# Altium schematic sheet Sheet1.SchDoc
size A3; SheetNumber: 1; SheetTotal: 1
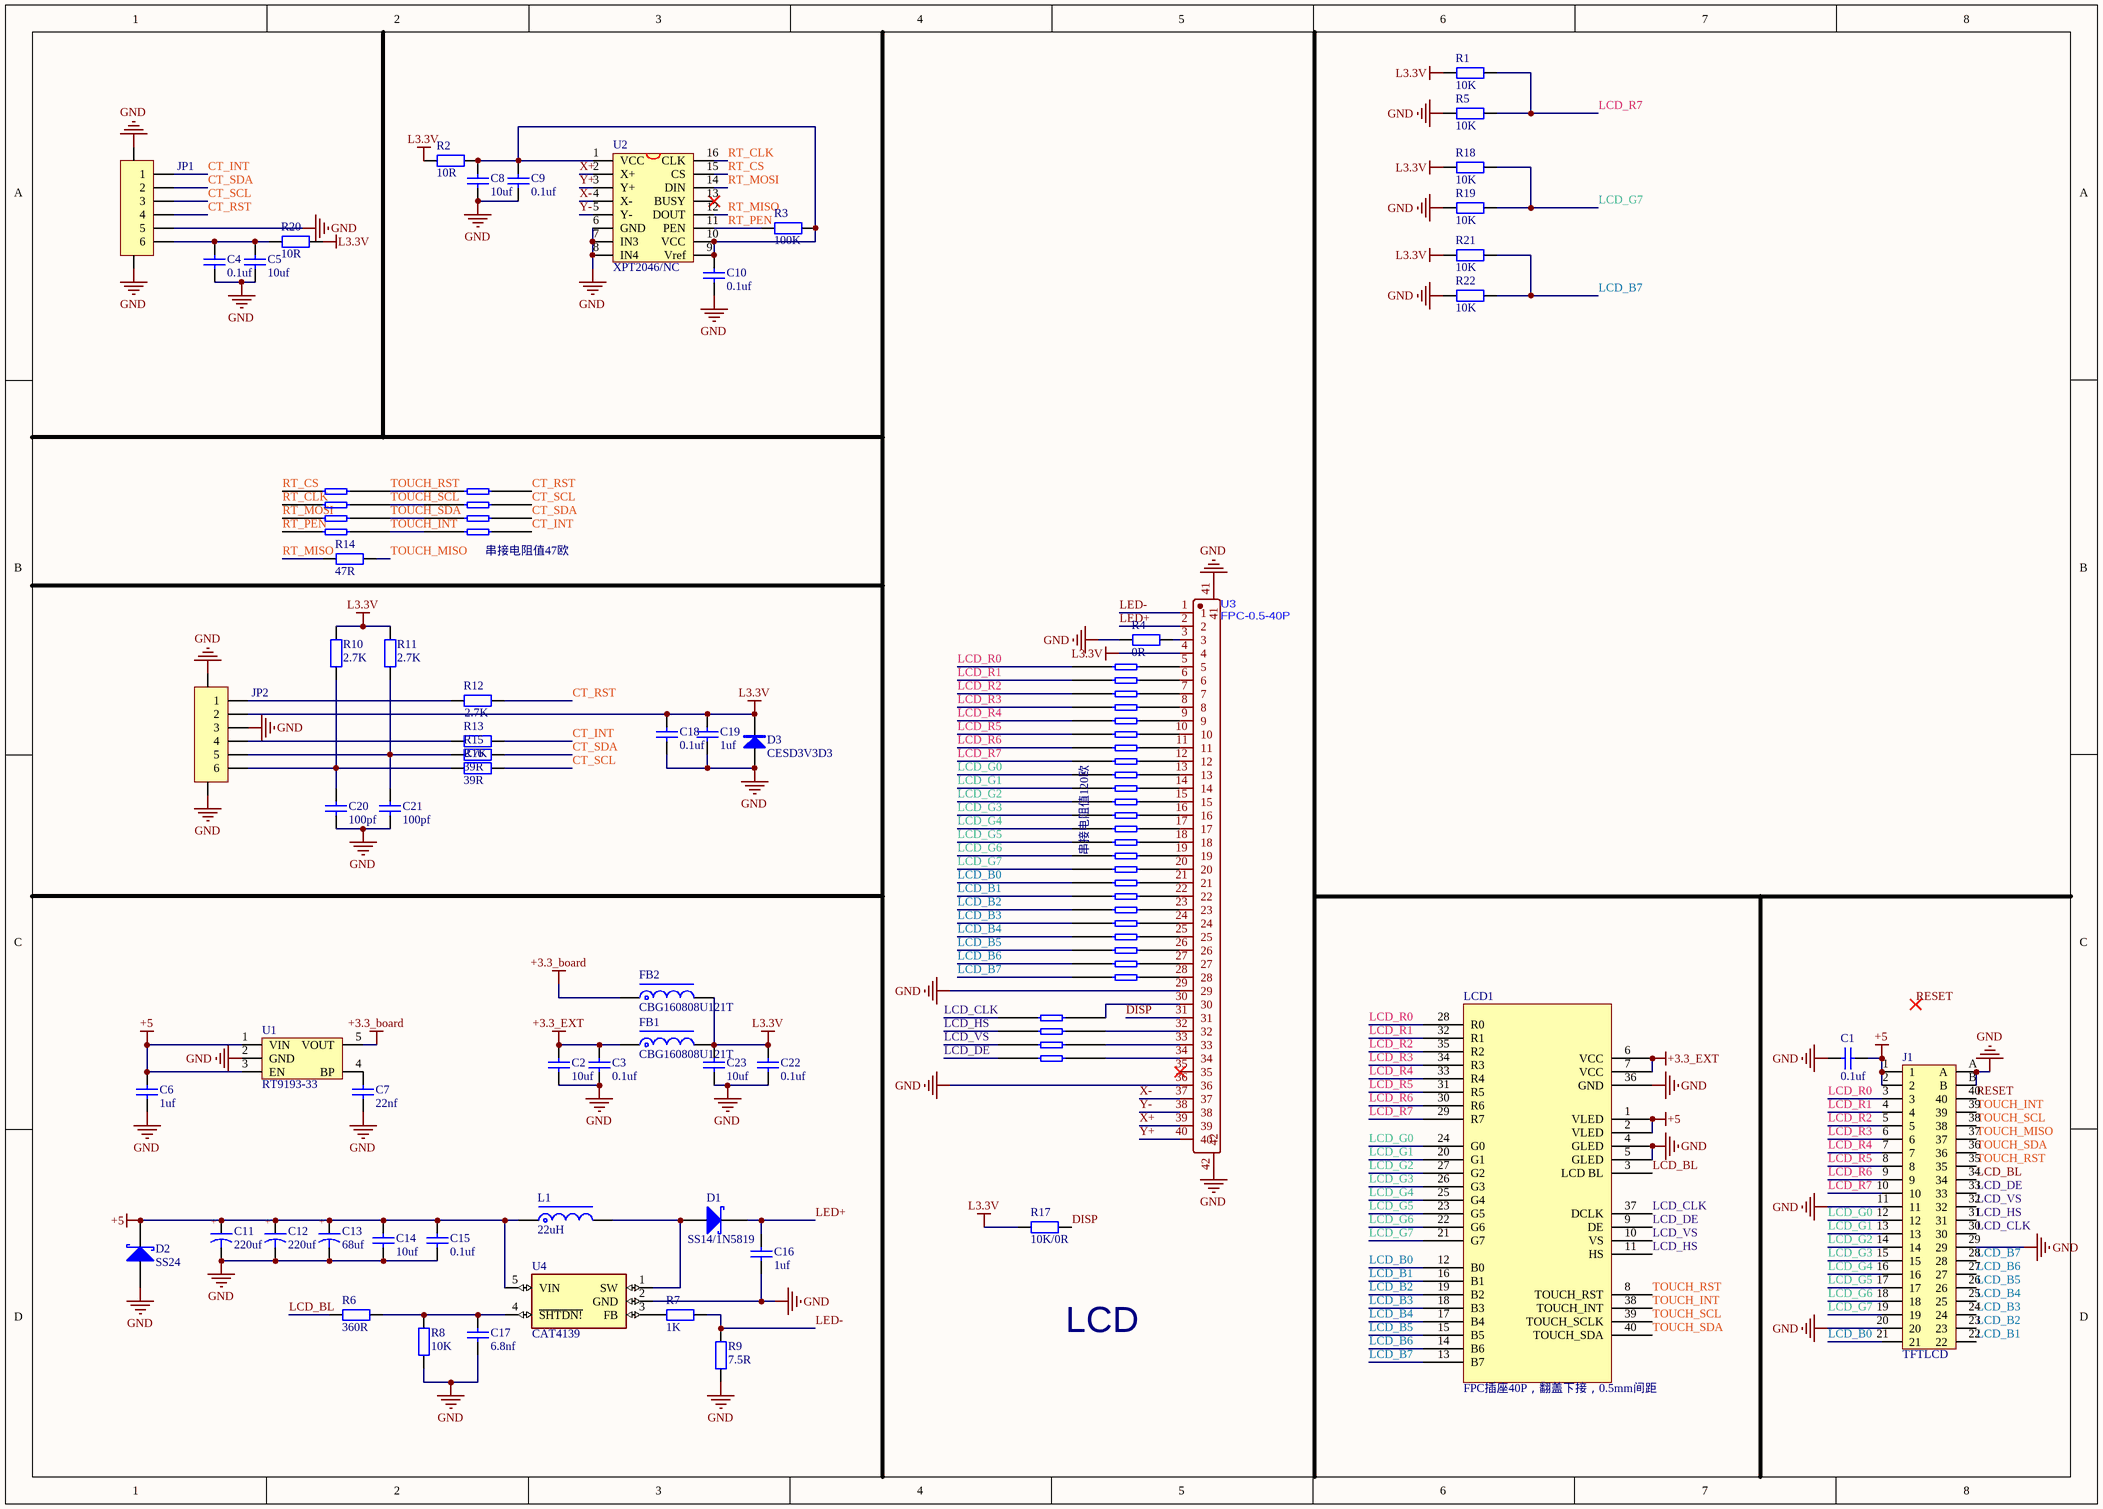
[diagram p0: Sheet1.SchDoc]

## Parts
C1  0.1uf  [C0603_L]
C2  10uf  [C0603_L]
C3  0.1uf  [C0603_L]
C4  0.1uf  [C0603_L]
C5  10uf  [C0603_L]
C6  1uf  [C0603_L]
C7  22nf  [C0603_L]
C8  10uf  [C0603_L]
C9  0.1uf  [C0603_L]
C10  0.1uf  [C0603_L]
C11  220uf  [CE A(3*5.4)]
C12  220uf  [CE A(3*5.4)]
C13  68uf  [CE A(3*5.4)]
C14  10uf  [C0603_L]
C15  0.1uf  [C0603_L]
C16  1uf  [C0603_L]
C17  6.8nf  [C0603_L]
C18  0.1uf  [C0603_L]
C19  1uf  [C0603_L]
C20  100pf  [C0603_L]
C21  100pf  [C0603_L]
C22  0.1uf  [C0603_L]
C23  10uf  [C0603_L]
D1  SS14/1N5819  [SMA]
D2  SS24  [SMA]
D3  CESD3V3D3  [SMA]
FB1  CBG160808U121T  [FB0805]
FB2  CBG160808U121T  [FB0805]
J1  TFTLCD  [FPC-TOP40]
JP1  CON-6P  [FPC0.5-WT-6P]  (value not drawn)
JP2  CON-6P  [FPC0.5-WT-6P]  (value not drawn)
L1  22uH  [L-SMD-0420]
LCD1  FPC插座40P，翻盖下接，0.5mm间距  [FPC40P-0.5MM]
R1  10K  [R0603_L]
R2  10R  [R0603_L]
R3  100K  [R0603_L]
R4  0R  [R0603_L]
R5  10K  [R0603_L]
R6  360R  [R0603_L]
R7  1K  [R0603_L]
R8  10K  [R0603_L]
R9  7.5R  [R0603_L]
R10  2.7K  [R0603_L]
R11  2.7K  [R0603_L]
R12  2.7K  [R0603_L]
R13  2.7K  [R0603_L]
R14  47R  [R0603_L]
R15  39R  [R0603_L]
R16  39R  [R0603_L]
R17  10K/0R  [R0603_L]
R18  10K  [R0603_L]
R19  10K  [R0603_L]
R20  10R  [R0603_L]
R21  10K  [R0603_L]
R22  10K  [R0603_L]
RP1  120R排阻  [0603_4P]  (value not drawn)
RP2  120R排阻  [0603_4P]  (value not drawn)
RP3  120R排阻  [0603_4P]  (value not drawn)
RP4  120R排阻  [0603_4P]  (value not drawn)
RP5  120R排阻  [0603_4P]  (value not drawn)
RP6  47R排阻  [0603_4P]  (value not drawn)
RP7  47R排阻  [0603_4P]  (value not drawn)
RP8  120R排阻  [0603_4P]  (value not drawn)
RP9  120R排阻  [0603_4P]  (value not drawn)
U1  RT9193-33  [SOT-23-5]
U2  XPT2046/NC  [SSOP16]
U3  FPC-0.5-40P  [CONN-SMD_FPC-0.5-40P]
U4  CAT4139  [SOT-23(OT)5_LEAD]

## Nets
+3.3_board: FB2.1 U1.5(VOUT)
+3.3_EXT: C2.2 C3.2 FB1.1 LCD1.6(VCC) LCD1.7(VCC)
+5: C1.1 C6.2 C11.1 C12.1 C13.1 C14.2 C15.2 D2.2(K) J1.1 J1.2 L1.1 LCD1.1(VLED) LCD1.2(VLED) U1.1(VIN) U1.3(EN) U4.5(VIN)
GND: C1.2 C2.1 C3.1 C4.1 C5.1 C6.1 C7.1 C8.1 C9.1 C10.1 C11.2 C12.2 C13.2 C14.1 C15.1 C16.1 C17.1 C18.1 C19.1 C20.1 C21.1 C22.1 C23.1 D2.1(A) D3.1(A) J1.11 J1.20 J1.29 J1.A J1.B JP1.0 JP1.5 JP2.0 JP2.3 LCD1.4(GLED) LCD1.5(GLED) LCD1.36(GND) R4.2 R5.2 R8.2 R9.2 R19.2 R22.2 U1.2(GND) U2.6(GND) U2.7(IN3) U2.8(IN4) U3.29 U3.36 U3.41 U3.42 U4.2(GND)
L3.3V: C18.2 C19.2 C22.2 C23.2 D3.2(K) FB1.2 FB2.2 JP2.2 R1.2 R2.2 R10.2 R11.2 R17.1 R18.2 R20.1 R21.2 U3.4
CT_INT: JP1.1 R13.1 RP7.5
CT_RST: JP1.4 R12.1 RP7.8
CT_SCL: JP1.3 R16.1 RP7.7
CT_SDA: JP1.2 R15.1 RP7.6
DISP: R17.2 U3.31
LCD_B0: J1.21 LCD1.12(B0) RP5.1
LCD_B1: J1.22 LCD1.16(B1) RP5.2
LCD_B2: J1.23 LCD1.19(B2) RP5.3
LCD_B3: J1.24 LCD1.18(B3) RP5.4
LCD_B4: J1.25 LCD1.17(B4) RP8.1
LCD_B5: J1.26 LCD1.15(B5) RP8.2
LCD_B6: J1.27 LCD1.14(B6) RP8.3
LCD_B7: J1.28 LCD1.13(B7) R21.1 R22.1 RP8.4
LCD_BL: J1.34 LCD1.3(LCD_BL) R6.2
LCD_CLK: J1.30 LCD1.37(DCLK) RP9.1
LCD_DE: J1.33 LCD1.9(DE) RP9.4
LCD_G0: J1.12 LCD1.24(G0) RP3.1
LCD_G1: J1.13 LCD1.20(G1) RP3.2
LCD_G2: J1.14 LCD1.27(G2) RP3.3
LCD_G3: J1.15 LCD1.26(G3) RP3.4
LCD_G4: J1.16 LCD1.25(G4) RP4.1
LCD_G5: J1.17 LCD1.23(G5) RP4.2
LCD_G6: J1.18 LCD1.22(G6) RP4.3
LCD_G7: J1.19 LCD1.21(G7) R18.1 R19.1 RP4.4
LCD_HS: J1.31 LCD1.11(HS) RP9.2
LCD_R0: J1.3 LCD1.28(R0) RP1.1
LCD_R1: J1.4 LCD1.32(R1) RP1.2
LCD_R2: J1.5 LCD1.35(R2) RP1.3
LCD_R3: J1.6 LCD1.34(R3) RP1.4
LCD_R4: J1.7 LCD1.33(R4) RP2.1
LCD_R5: J1.8 LCD1.31(R5) RP2.2
LCD_R6: J1.9 LCD1.30(R6) RP2.3
LCD_R7: J1.10 LCD1.29(R7) R1.1 R5.1 RP2.4
LCD_VS: J1.32 LCD1.10(VS) RP9.3
LED+: C16.2 D1.2(K) U3.2
LED-: R7.1 R9.1 U3.1
RESET: J1.40
RT_CLK: RP6.2 U2.16(CLK)
RT_CS: RP6.1 U2.15(CS)
RT_MISO: R14.2 U2.12(DOUT)
RT_MOSI: RP6.3 U2.14(DIN)
RT_PEN: R3.2 RP6.4 U2.11(PEN)
TOUCH_INT: J1.39 LCD1.38(TOUCH_INT) RP6.5 RP7.4
TOUCH_MISO: J1.37 R14.1
TOUCH_RST: J1.35 LCD1.8(TOUCH_RST) RP6.8 RP7.1
TOUCH_SCL: J1.38 LCD1.39(TOUCH_SCLK) RP6.7 RP7.2
TOUCH_SDA: J1.36 LCD1.40(TOUCH_SDA) RP6.6 RP7.3
X+: U2.2(X+) U3.39
X-: U2.4(X-) U3.37
Y+: U2.3(Y+) U3.40
Y-: U2.5(Y-) U3.38
NetC4_2: C4.2 C5.2 JP1.6 R20.2
NetC7_2: C7.2 U1.4(BP)
NetC8_2: C8.2 C9.2 C10.2 R2.1 R3.1 U2.1(VCC) U2.9(Vref) U2.10(VCC)
NetC17_2: C17.2 R6.1 R8.1 U4.4(~{SHTDN!})
NetC20_2: C20.2 JP2.6 R10.1 R16.2
NetC21_2: C21.2 JP2.5 R11.1 R15.2
NetD1_1: D1.1(A) L1.2 U4.1(SW)
NetJP2_1: JP2.1 R12.2
NetJP2_4: JP2.4 R13.2
NetR4_1: R4.1 U3.3
NetR7_2: R7.2 U4.3(FB)
NetRP1_5: RP1.5 U3.8
NetRP1_6: RP1.6 U3.7
NetRP1_7: RP1.7 U3.6
NetRP1_8: RP1.8 U3.5
NetRP2_5: RP2.5 U3.12
NetRP2_6: RP2.6 U3.11
NetRP2_7: RP2.7 U3.10
NetRP2_8: RP2.8 U3.9
NetRP3_5: RP3.5 U3.16
NetRP3_6: RP3.6 U3.15
NetRP3_7: RP3.7 U3.14
NetRP3_8: RP3.8 U3.13
NetRP4_5: RP4.5 U3.20
NetRP4_6: RP4.6 U3.19
NetRP4_7: RP4.7 U3.18
NetRP4_8: RP4.8 U3.17
NetRP5_5: RP5.5 U3.24
NetRP5_6: RP5.6 U3.23
NetRP5_7: RP5.7 U3.22
NetRP5_8: RP5.8 U3.21
NetRP8_5: RP8.5 U3.28
NetRP8_6: RP8.6 U3.27
NetRP8_7: RP8.7 U3.26
NetRP8_8: RP8.8 U3.25
NetRP9_5: RP9.5 U3.34
NetRP9_6: RP9.6 U3.33
NetRP9_7: RP9.7 U3.32
NetRP9_8: RP9.8 U3.30

Not connected (* = marked no-connect by the designer): U2 13(BUSY)*; U3 35*

## Notes on the sheet
- (near RP7) 串接电阻值47欧
- 串接电阻值120欧
- LCD
- Labels drawn without touching a wire or pin: RESET
- (in symbol CE_SMD) +

## Library data of the parts
C1-C10 C14-C23 = C: 贴片电容/MLCC电容
C11-C13 = CE_SMD: 贴片电解电容
D1 D2 = SS14: 肖特基二极管
D3 = 1N4007: 整流二极管
FB1 FB2 = FB: 贴片磁珠
J1 = FPC-40: FPC-40P-0.5mm
JP1 JP2 = Header 6: 6P连接器
L1 = L-Molding Choke: 一体成型电感
LCD1 = MY-RGB
R1-R22 = R: 贴片电阻
RP1-RP9 = RES_4P
U1 = RT9193-33: 3.3V超低压差LDO
U2 = ADS7843
U4 = CAT4139: LED Driver IC 1 Output DC DC Regulator Step-Up (Boost) Analog, PWM Dimming 750mA (Switch) TSOT-23-5